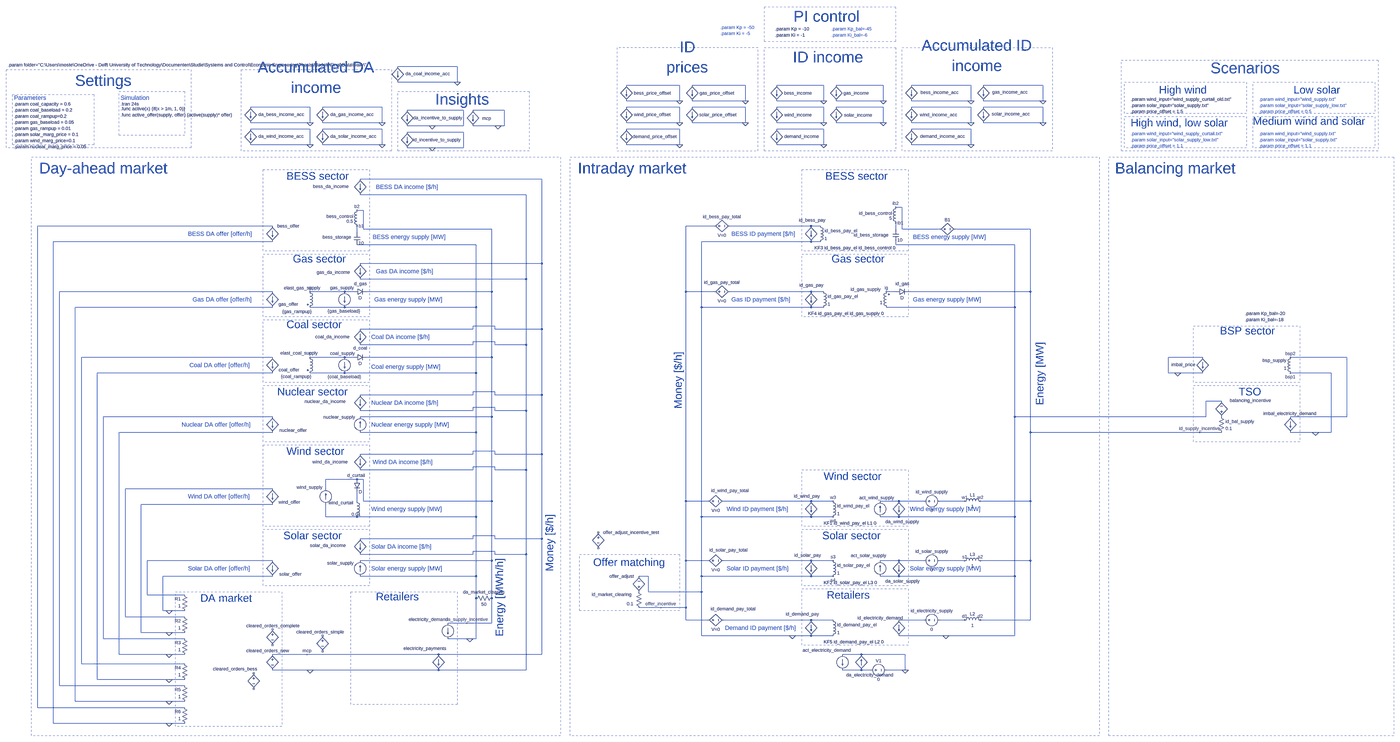
[diagram p0: schematic base.asc, whole sheet]
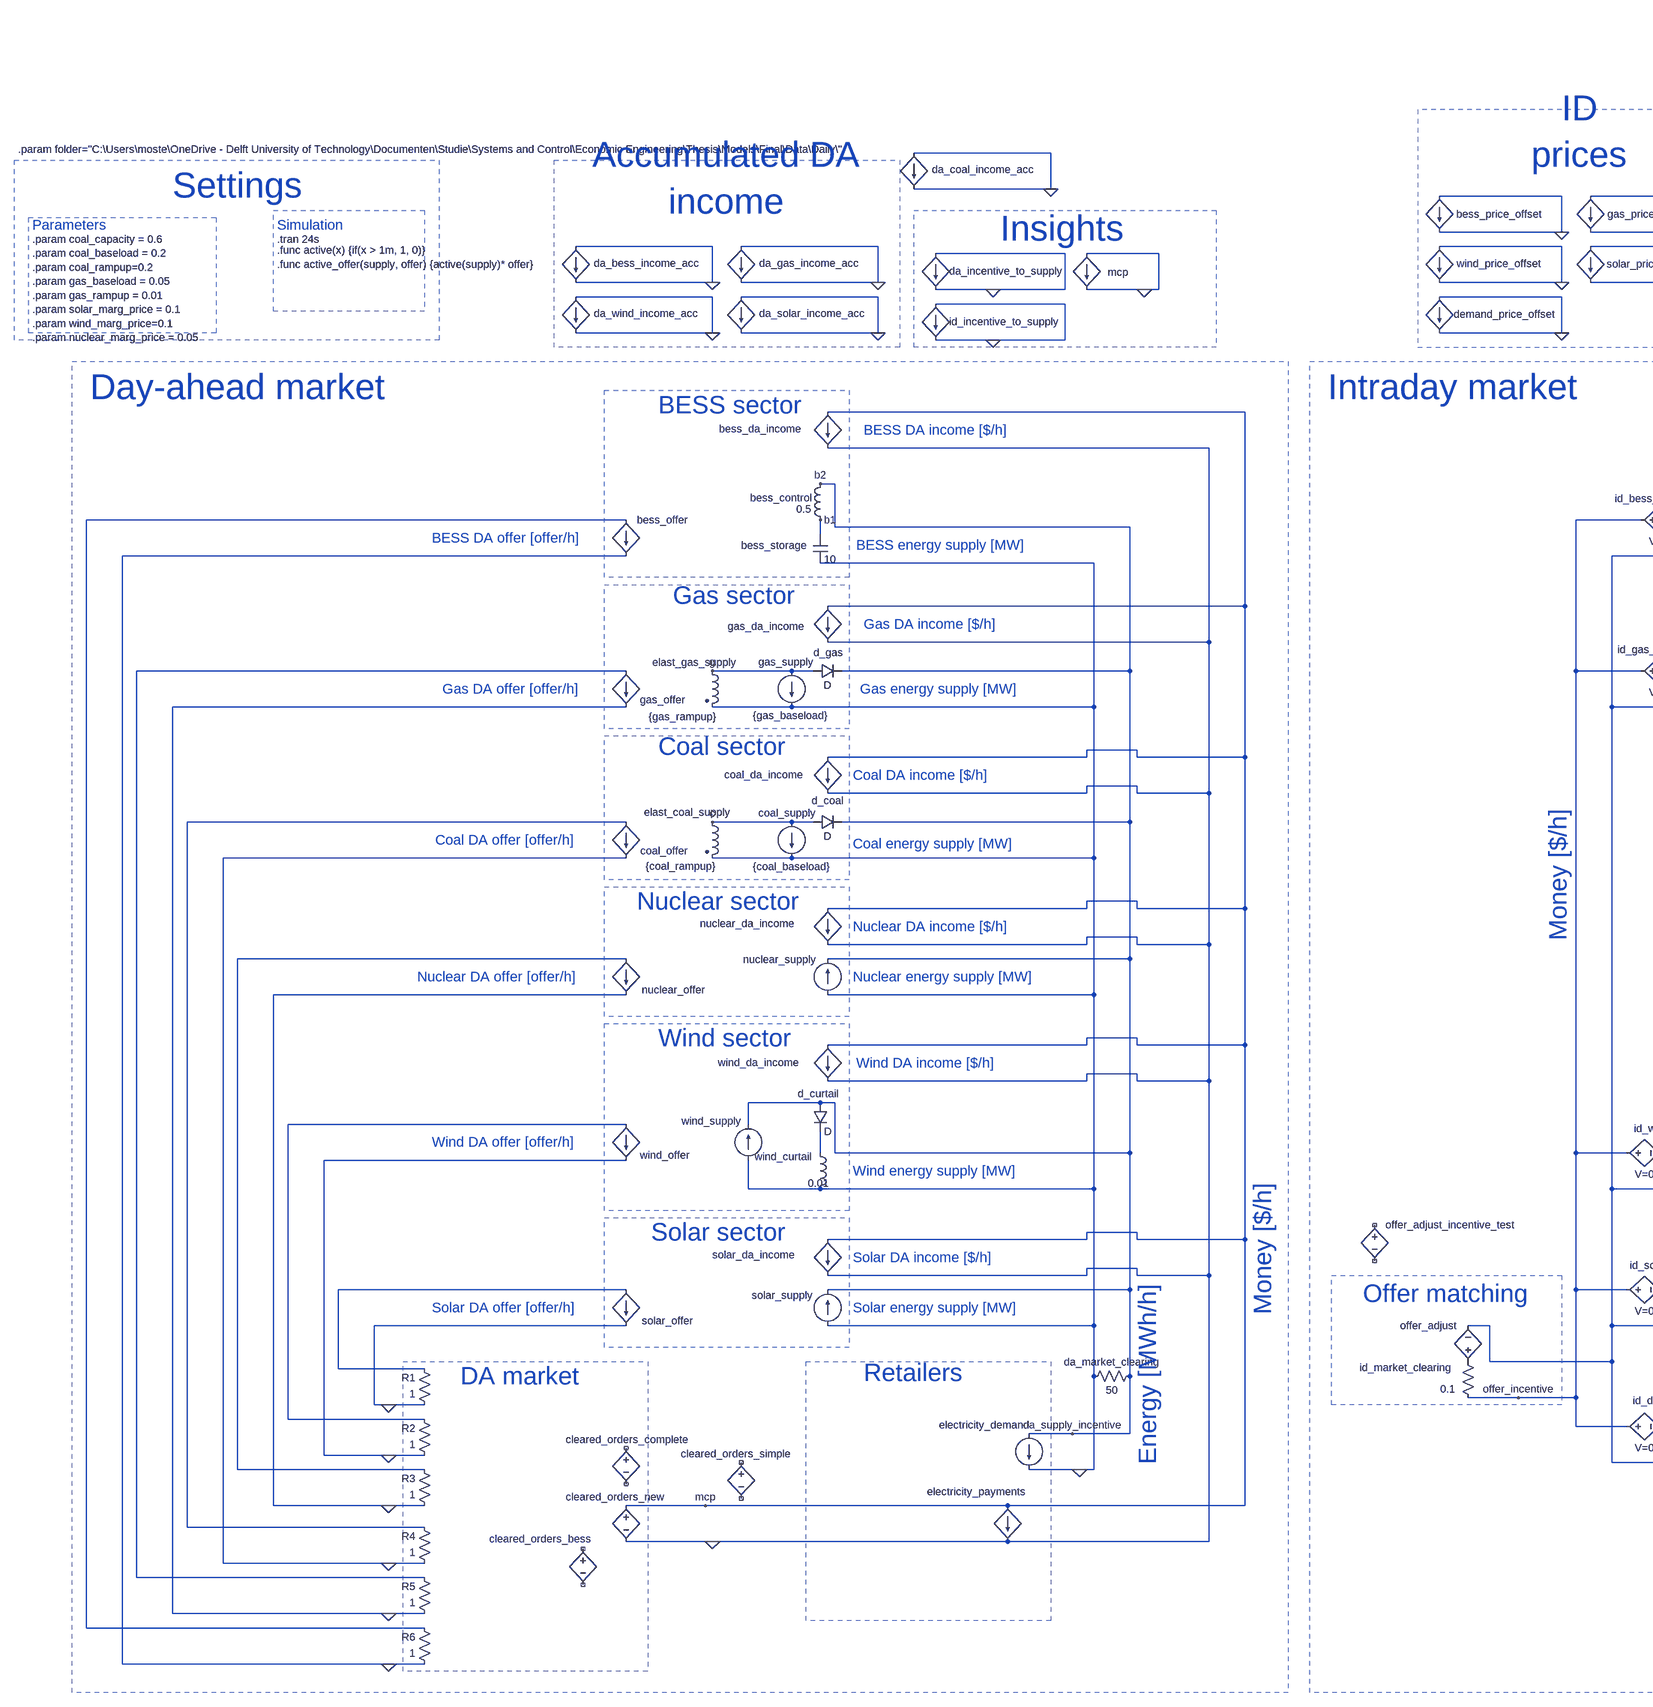
[diagram p1: schematic base.asc, part, row 1 of 1, column 1 of 2]
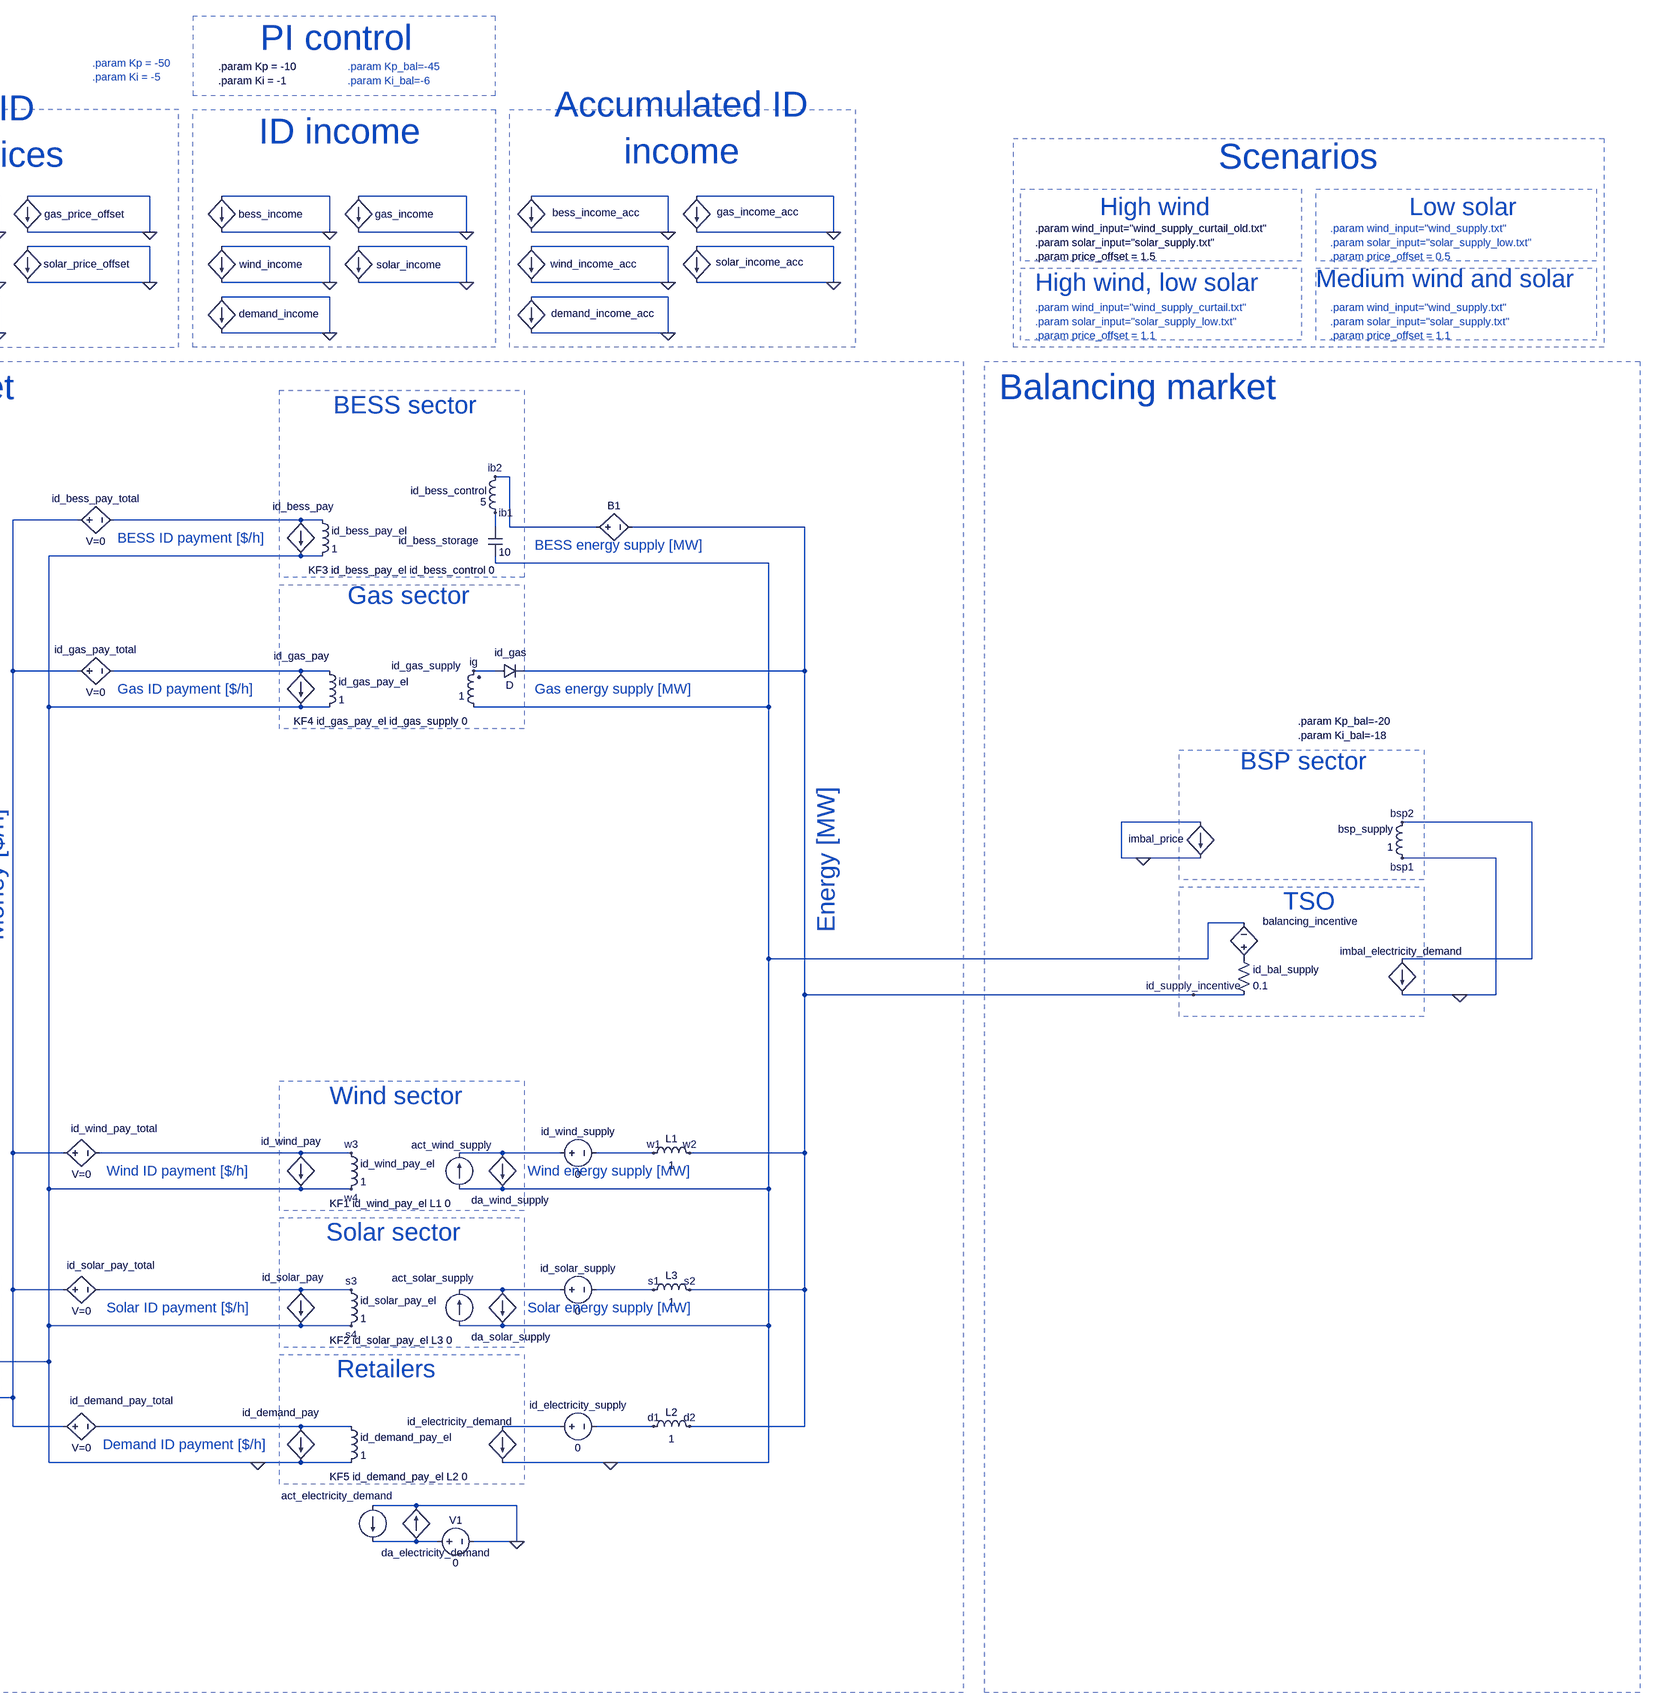
[diagram p2: schematic base.asc, part, row 1 of 1, column 2 of 2]
base.asc, the LTspice schematic file:
Version 4.1
SHEET 1 7964 2928
WIRE 2464 -1344 2160 -1344
WIRE 2464 -1264 2464 -1344
WIRE 2464 -1264 2160 -1264
WIRE 3600 -1248 3328 -1248
WIRE 3936 -1248 3664 -1248
WIRE 4336 -1248 4096 -1248
WIRE 4640 -1248 4400 -1248
WIRE 5088 -1248 4784 -1248
WIRE 5456 -1248 5152 -1248
WIRE 3600 -1168 3600 -1248
WIRE 3600 -1168 3328 -1168
WIRE 3936 -1168 3936 -1248
WIRE 3936 -1168 3664 -1168
WIRE 4336 -1168 4336 -1248
WIRE 4336 -1168 4096 -1168
WIRE 4640 -1168 4640 -1248
WIRE 4640 -1168 4400 -1168
WIRE 5088 -1168 5088 -1248
WIRE 5088 -1168 4784 -1168
WIRE 5456 -1168 5456 -1248
WIRE 5456 -1168 5152 -1168
WIRE 1712 -1136 1408 -1136
WIRE 2080 -1136 1776 -1136
WIRE 3600 -1136 3328 -1136
WIRE 3936 -1136 3664 -1136
WIRE 4336 -1136 4096 -1136
WIRE 4640 -1136 4400 -1136
WIRE 5088 -1136 4784 -1136
WIRE 5456 -1136 5152 -1136
WIRE 2496 -1120 2208 -1120
WIRE 2704 -1120 2544 -1120
WIRE 1712 -1056 1712 -1136
WIRE 1712 -1056 1408 -1056
WIRE 2080 -1056 2080 -1136
WIRE 2080 -1056 1776 -1056
WIRE 3600 -1056 3600 -1136
WIRE 3600 -1056 3328 -1056
WIRE 3936 -1056 3936 -1136
WIRE 3936 -1056 3664 -1056
WIRE 4336 -1056 4336 -1136
WIRE 4336 -1056 4096 -1056
WIRE 4640 -1056 4640 -1136
WIRE 4640 -1056 4400 -1056
WIRE 5088 -1056 5088 -1136
WIRE 5088 -1056 4784 -1056
WIRE 5456 -1056 5456 -1136
WIRE 5456 -1056 5152 -1056
WIRE 2336 -1040 2208 -1040
WIRE 2496 -1040 2496 -1120
WIRE 2496 -1040 2336 -1040
WIRE 2672 -1040 2544 -1040
WIRE 2704 -1040 2704 -1120
WIRE 2704 -1040 2672 -1040
WIRE 1712 -1024 1408 -1024
WIRE 2080 -1024 1776 -1024
WIRE 3600 -1024 3328 -1024
WIRE 4336 -1024 4096 -1024
WIRE 5088 -1024 4784 -1024
WIRE 2496 -1008 2208 -1008
WIRE 1712 -944 1712 -1024
WIRE 1712 -944 1408 -944
WIRE 2080 -944 2080 -1024
WIRE 2080 -944 1776 -944
WIRE 3600 -944 3600 -1024
WIRE 3600 -944 3328 -944
WIRE 4336 -944 4336 -1024
WIRE 4336 -944 4096 -944
WIRE 5088 -944 5088 -1024
WIRE 5088 -944 4784 -944
WIRE 2336 -928 2208 -928
WIRE 2496 -928 2496 -1008
WIRE 2496 -928 2336 -928
WIRE 2896 -768 1968 -768
WIRE 2816 -688 1968 -688
WIRE 4736 -624 4704 -624
WIRE 1984 -608 1952 -608
WIRE 1520 -528 320 -528
WIRE 3776 -528 3632 -528
WIRE 4272 -528 3856 -528
WIRE 4320 -528 4272 -528
WIRE 1984 -512 1984 -608
WIRE 2640 -512 1984 -512
WIRE 4704 -512 4704 -544
WIRE 4736 -512 4736 -624
WIRE 4928 -512 4736 -512
WIRE 5392 -512 5008 -512
WIRE 1952 -496 1952 -528
WIRE 1520 -448 400 -448
WIRE 4272 -448 3712 -448
WIRE 4320 -448 4272 -448
WIRE 2560 -432 1952 -432
WIRE 4704 -432 4704 -448
WIRE 5312 -432 4704 -432
WIRE 2896 -336 2896 -768
WIRE 2896 -336 1968 -336
WIRE 2816 -256 2816 -688
WIRE 2816 -256 1968 -256
WIRE 1520 -192 432 -192
WIRE 1888 -192 1712 -192
WIRE 1936 -192 1888 -192
WIRE 2640 -192 2640 -512
WIRE 2640 -192 2000 -192
WIRE 3632 -192 3632 -528
WIRE 3776 -192 3632 -192
WIRE 4272 -192 3856 -192
WIRE 4336 -192 4272 -192
WIRE 4704 -192 4656 -192
WIRE 5392 -192 5392 -512
WIRE 5392 -192 4768 -192
WIRE 1520 -112 512 -112
WIRE 1888 -112 1712 -112
WIRE 2560 -112 2560 -432
WIRE 2560 -112 1888 -112
WIRE 3712 -112 3712 -448
WIRE 4272 -112 3712 -112
WIRE 4336 -112 4272 -112
WIRE 5312 -112 5312 -432
WIRE 5312 -112 4656 -112
WIRE 2656 -16 2544 -16
WIRE 2544 0 2544 -16
WIRE 2544 0 1968 0
WIRE 2656 0 2656 -16
WIRE 2896 0 2896 -336
WIRE 2896 0 2656 0
WIRE 2656 64 2544 64
WIRE 2544 80 2544 64
WIRE 2544 80 1968 80
WIRE 2656 80 2656 64
WIRE 2816 80 2816 -256
WIRE 2816 80 2656 80
WIRE 1520 144 544 144
WIRE 1888 144 1712 144
WIRE 1936 144 1888 144
WIRE 2640 144 2640 -192
WIRE 2640 144 2000 144
WIRE 6272 144 6096 144
WIRE 7008 144 6720 144
WIRE 1520 224 624 224
WIRE 1888 224 1712 224
WIRE 2560 224 2560 -112
WIRE 2560 224 1888 224
WIRE 6096 224 6096 144
WIRE 6144 224 6096 224
WIRE 6272 224 6144 224
WIRE 6928 224 6720 224
WIRE 2656 320 2544 320
WIRE 2544 336 2544 320
WIRE 2544 336 1968 336
WIRE 2656 336 2656 320
WIRE 2896 336 2896 0
WIRE 2896 336 2656 336
WIRE 6368 368 6288 368
WIRE 2656 400 2544 400
WIRE 2544 416 2544 400
WIRE 2544 416 1968 416
WIRE 2656 416 2656 400
WIRE 2816 416 2816 80
WIRE 2816 416 2656 416
WIRE 1520 448 656 448
WIRE 2640 448 2640 144
WIRE 2640 448 1968 448
WIRE 5312 448 5312 -112
WIRE 6288 448 6288 368
WIRE 6288 448 5312 448
WIRE 7008 448 7008 144
WIRE 7008 448 6720 448
WIRE 1520 528 736 528
WIRE 2560 528 2560 224
WIRE 2560 528 1968 528
WIRE 5392 528 5392 -192
WIRE 6256 528 5392 528
WIRE 6368 528 6256 528
WIRE 6848 528 6720 528
WIRE 6928 528 6928 224
WIRE 6928 528 6848 528
WIRE 2656 624 2544 624
WIRE 2544 640 2544 624
WIRE 2544 640 1968 640
WIRE 2656 640 2656 624
WIRE 2896 640 2896 336
WIRE 2896 640 2656 640
WIRE 2656 704 2544 704
WIRE 2544 720 2544 704
WIRE 2544 720 1968 720
WIRE 2656 720 2656 704
WIRE 2816 720 2816 416
WIRE 2816 720 2656 720
WIRE 1952 768 1792 768
WIRE 1984 768 1952 768
WIRE 1520 816 768 816
WIRE 1792 816 1792 768
WIRE 1952 880 1952 832
WIRE 1984 880 1984 768
WIRE 2640 880 2640 448
WIRE 2640 880 1984 880
WIRE 3632 880 3632 -192
WIRE 3744 880 3632 880
WIRE 4272 880 3824 880
WIRE 4384 880 4272 880
WIRE 4720 880 4624 880
WIRE 4848 880 4720 880
WIRE 5056 880 4928 880
WIRE 5392 880 5392 528
WIRE 5392 880 5136 880
WIRE 1520 896 848 896
WIRE 1792 960 1792 896
WIRE 1952 960 1792 960
WIRE 2560 960 2560 528
WIRE 2560 960 1952 960
WIRE 3712 960 3712 -112
WIRE 4272 960 3712 960
WIRE 4384 960 4272 960
WIRE 4720 960 4624 960
WIRE 5312 960 5312 448
WIRE 5312 960 4720 960
WIRE 2656 1056 2544 1056
WIRE 2544 1072 2544 1056
WIRE 2544 1072 1968 1072
WIRE 2656 1072 2656 1056
WIRE 2896 1072 2896 640
WIRE 2896 1072 2656 1072
WIRE 2656 1136 2544 1136
WIRE 2544 1152 2544 1136
WIRE 2544 1152 1968 1152
WIRE 2656 1152 2656 1136
WIRE 2816 1152 2816 720
WIRE 2816 1152 2656 1152
WIRE 1520 1184 880 1184
WIRE 2640 1184 2640 880
WIRE 2640 1184 1968 1184
WIRE 3632 1184 3632 880
WIRE 3744 1184 3632 1184
WIRE 4272 1184 3824 1184
WIRE 4384 1184 4272 1184
WIRE 4720 1184 4624 1184
WIRE 4848 1184 4720 1184
WIRE 5056 1184 4928 1184
WIRE 5392 1184 5392 880
WIRE 5392 1184 5136 1184
WIRE 1520 1264 960 1264
WIRE 2560 1264 2560 960
WIRE 2560 1264 1968 1264
WIRE 3440 1264 3392 1264
WIRE 3712 1264 3712 960
WIRE 4272 1264 3712 1264
WIRE 4384 1264 4272 1264
WIRE 4720 1264 4624 1264
WIRE 5312 1264 5312 960
WIRE 5312 1264 4720 1264
WIRE 3440 1344 3440 1264
WIRE 3712 1344 3712 1264
WIRE 3712 1344 3440 1344
WIRE 880 1360 880 1184
WIRE 1072 1360 880 1360
WIRE 2560 1376 2560 1264
WIRE 2640 1376 2640 1184
WIRE 3504 1424 3392 1424
WIRE 3632 1424 3632 1184
WIRE 3632 1424 3504 1424
WIRE 960 1440 960 1264
WIRE 992 1440 960 1440
WIRE 1072 1440 992 1440
WIRE 768 1472 768 816
WIRE 1072 1472 768 1472
WIRE 3632 1488 3632 1424
WIRE 3744 1488 3632 1488
WIRE 4272 1488 3824 1488
WIRE 4384 1488 4272 1488
WIRE 4848 1488 4720 1488
WIRE 5056 1488 4928 1488
WIRE 5392 1488 5392 1184
WIRE 5392 1488 5136 1488
WIRE 2512 1504 2416 1504
WIRE 2640 1504 2640 1376
WIRE 2640 1504 2512 1504
WIRE 848 1552 848 896
WIRE 992 1552 848 1552
WIRE 1072 1552 992 1552
WIRE 3712 1568 3712 1344
WIRE 4176 1568 3712 1568
WIRE 4272 1568 4176 1568
WIRE 4384 1568 4272 1568
WIRE 4960 1568 4720 1568
WIRE 5312 1568 5312 1264
WIRE 5312 1568 4960 1568
WIRE 656 1584 656 448
WIRE 1072 1584 656 1584
WIRE 2528 1584 2416 1584
WIRE 2560 1584 2560 1376
WIRE 2560 1584 2528 1584
WIRE 736 1664 736 528
WIRE 992 1664 736 1664
WIRE 1072 1664 992 1664
WIRE 1696 1664 1520 1664
WIRE 2368 1664 1696 1664
WIRE 2896 1664 2896 1072
WIRE 2896 1664 2368 1664
WIRE 4528 1664 4432 1664
WIRE 4752 1664 4528 1664
WIRE 544 1712 544 144
WIRE 1072 1712 544 1712
WIRE 1712 1744 1520 1744
WIRE 2368 1744 1712 1744
WIRE 2816 1744 2816 1152
WIRE 2816 1744 2368 1744
WIRE 4528 1744 4432 1744
WIRE 4576 1744 4528 1744
WIRE 4752 1744 4752 1664
WIRE 4752 1744 4656 1744
WIRE 624 1792 624 224
WIRE 992 1792 624 1792
WIRE 1072 1792 992 1792
WIRE 432 1824 432 -192
WIRE 1072 1824 432 1824
WIRE 512 1904 512 -112
WIRE 992 1904 512 1904
WIRE 1072 1904 992 1904
WIRE 320 1936 320 -528
WIRE 1072 1936 320 1936
WIRE 400 2016 400 -448
WIRE 992 2016 400 2016
WIRE 1072 2016 992 2016
FLAG 2528 1584 0
FLAG 1712 144 c
FLAG 1712 -192 g
FLAG 992 1440 0
FLAG 992 1552 0
FLAG 992 1664 0
FLAG 992 1792 0
FLAG 992 1904 0
FLAG 1712 1744 0
FLAG 1696 1664 mcp
FLAG 1952 -528 b1
FLAG 1952 -608 b2
FLAG 2672 -1040 0
FLAG 992 2016 0
FLAG 4656 -192 ig
FLAG 4704 -544 ib1
FLAG 6256 528 id_supply_incentive
FLAG 2336 -1040 0
FLAG 4176 1568 0
FLAG 5056 880 w1
FLAG 5136 880 w2
FLAG 5056 1184 s1
FLAG 5136 1184 s2
FLAG 4384 880 w3
FLAG 4384 960 w4
FLAG 4384 1184 s3
FLAG 4384 1264 s4
FLAG 5056 1488 d1
FLAG 5136 1488 d2
FLAG 4704 -624 ib2
FLAG 3600 -1056 0
FLAG 3600 -1168 0
FLAG 3936 -1056 0
FLAG 3600 -944 0
FLAG 4960 1568 0
FLAG 4752 1744 0
FLAG 4336 -944 0
FLAG 4640 -1056 0
FLAG 4336 -1056 0
FLAG 4336 -1168 0
FLAG 5088 -944 0
FLAG 3936 -1168 0
FLAG 4640 -1168 0
FLAG 5456 -1056 0
FLAG 5088 -1056 0
FLAG 5088 -1168 0
FLAG 5456 -1168 0
FLAG 6848 528 0
FLAG 6720 224 bsp1
FLAG 6720 144 bsp2
FLAG 6144 224 0
FLAG 2080 -944 0
FLAG 1712 -944 0
FLAG 1712 -1056 0
FLAG 2080 -1056 0
FLAG 3504 1424 offer_incentive
FLAG 2512 1504 da_supply_incentive
FLAG 2464 -1264 0
FLAG 2336 -928 0
DATAFLAG 2816 -224 ""
SYMBOL ind 1936 864 R0
WINDOW 0 -130 24 Left 2
WINDOW 3 -12 83 Left 2
SYMATTR InstName wind_curtail
SYMATTR Value 0.01
SYMBOL diode 1936 768 R0
WINDOW 0 -34 -20 Left 2
SYMATTR InstName d_curtail
SYMBOL current 1968 1264 R180
WINDOW 0 33 68 Left 2
WINDOW 3 24 0 Invisible 2
WINDOW 123 0 0 Left 0
WINDOW 39 0 0 Left 0
SYMATTR InstName solar_supply
SYMATTR Value PWL file={folder+ solar_input}
SYMBOL current 1792 896 R180
WINDOW 0 16 87 Left 2
WINDOW 3 24 0 Invisible 2
WINDOW 123 0 0 Left 0
WINDOW 39 0 0 Left 0
SYMATTR InstName wind_supply
SYMATTR Value PWL file={folder+ wind_input}
SYMBOL current 1968 528 R180
WINDOW 0 25 78 Left 2
WINDOW 3 24 80 Invisible 2
WINDOW 123 0 0 Left 0
WINDOW 39 0 0 Left 0
SYMATTR InstName nuclear_supply
SYMATTR Value PWL file="C:\Users\moste\OneDrive - Delft University of Technology\Documenten\Studie\Systems and Control\Economic Engineering\Thesis\Models\Data\nuclear_supply.txt"
SYMBOL current 1888 144 R0
WINDOW 0 -74 -20 Left 2
WINDOW 3 -86 99 Left 2
WINDOW 123 0 0 Left 0
WINDOW 39 0 0 Left 0
SYMATTR InstName coal_supply
SYMATTR Value {coal_baseload}
SYMBOL ind2 1696 128 R0
WINDOW 0 -136 -6 Left 2
WINDOW 3 -133 114 Left 2
SYMATTR InstName elast_coal_supply
SYMATTR Value {coal_rampup}
SYMATTR Type ind
SYMATTR SpiceLine Rser=1u
SYMBOL diode 1936 160 R270
WINDOW 0 48 32 VTop 2
WINDOW 3 0 32 VBottom 2
SYMATTR InstName d_coal
SYMBOL current 1888 -192 R0
WINDOW 0 -74 -20 Left 2
WINDOW 3 -86 99 Left 2
WINDOW 123 0 0 Left 0
WINDOW 39 0 0 Left 0
SYMATTR InstName gas_supply
SYMATTR Value {gas_baseload}
SYMBOL ind2 1696 -208 R0
WINDOW 0 -118 -3 Left 2
WINDOW 3 -126 118 Left 2
SYMATTR InstName elast_gas_supply
SYMATTR Value {gas_rampup}
SYMATTR Type ind
SYMATTR SpiceLine Rser=1u
SYMBOL diode 1936 -176 R270
WINDOW 0 41 34 VTop 2
WINDOW 3 0 32 VBottom 2
SYMATTR InstName d_gas
SYMBOL current 2416 1504 R0
WINDOW 0 2 -19 Right 2
WINDOW 3 24 80 Invisible 2
WINDOW 123 0 0 Left 0
WINDOW 39 0 0 Left 0
SYMATTR InstName electricity_demand
SYMATTR Value PWL file="C:\Users\moste\OneDrive - Delft University of Technology\Documenten\Studie\Systems and Control\Economic Engineering\Thesis\Models\Data\electricity_demand_extended_increased.txt"
SYMBOL bi 1520 -192 R0
WINDOW 0 31 64 Left 2
WINDOW 3 24 80 Invisible 2
SYMATTR InstName gas_offer
SYMATTR Value I=I(d_gas)*{gas_rampup}*50
SYMBOL bi 1520 144 R0
WINDOW 0 32 64 Left 2
WINDOW 3 24 80 Invisible 2
SYMATTR InstName coal_offer
SYMATTR Value I=I(d_coal)*{coal_rampup}*2.5
SYMBOL bi 1520 448 R0
WINDOW 0 35 69 Left 2
WINDOW 3 24 80 Invisible 2
SYMATTR InstName nuclear_offer
SYMATTR Value I=active_offer(I(nuclear_supply), {nuclear_marg_price})
SYMBOL bi 1520 816 R0
WINDOW 0 31 69 Left 2
WINDOW 3 24 80 Invisible 2
SYMATTR InstName wind_offer
SYMATTR Value I=active_offer(I(wind_supply), -{wind_marg_price})
SYMBOL bi 1520 1184 R0
WINDOW 0 35 69 Left 2
WINDOW 3 24 80 Invisible 2
SYMATTR InstName solar_offer
SYMATTR Value I=active_offer(I(solar_supply), -{solar_marg_price})
SYMBOL res 1088 1456 R180
WINDOW 0 36 76 Left 2
WINDOW 3 36 40 Left 2
SYMATTR InstName R1
SYMATTR Value 1
SYMBOL res 1088 1568 R180
WINDOW 0 36 76 Left 2
WINDOW 3 36 40 Left 2
SYMATTR InstName R2
SYMATTR Value 1
SYMBOL res 1088 1680 R180
WINDOW 0 36 76 Left 2
WINDOW 3 36 40 Left 2
SYMATTR InstName R3
SYMATTR Value 1
SYMBOL res 1088 1808 R180
WINDOW 0 36 76 Left 2
WINDOW 3 36 40 Left 2
SYMATTR InstName R4
SYMATTR Value 1
SYMBOL res 1088 1920 R180
WINDOW 0 36 76 Left 2
WINDOW 3 36 40 Left 2
SYMATTR InstName R5
SYMATTR Value 1
SYMBOL bi 1968 -336 R0
WINDOW 3 24 80 Invisible 2
WINDOW 0 -222 45 Left 2
SYMATTR Value I=V(mcp)*I(d_gas)
SYMATTR InstName gas_da_income
SYMBOL bi 1968 0 R0
WINDOW 3 24 80 Invisible 2
WINDOW 0 -230 39 Left 2
SYMATTR Value I=V(mcp)*I(d_coal)
SYMATTR InstName coal_da_income
SYMBOL bi 1968 336 R0
WINDOW 3 24 80 Invisible 2
WINDOW 0 -284 34 Left 2
SYMATTR Value I=V(mcp)*I(nuclear_supply)
SYMATTR InstName nuclear_da_income
SYMBOL bi 1968 640 R0
WINDOW 3 24 80 Invisible 2
WINDOW 0 -244 39 Left 2
SYMATTR Value I=V(mcp)*I(wind_supply)
SYMATTR InstName wind_da_income
SYMBOL bi 1968 1072 R0
WINDOW 3 24 80 Invisible 2
WINDOW 0 -256 34 Left 2
SYMATTR Value I=V(mcp)*I(solar_supply)
SYMATTR InstName solar_da_income
SYMBOL bv 1776 1552 R0
WINDOW 3 24 96 Invisible 2
WINDOW 0 -134 -3 Left 2
SYMATTR Value V = MAX(I(R4), I(R5))
SYMATTR InstName cleared_orders_simple
SYMBOL bv 1520 1520 R0
WINDOW 3 24 96 Invisible 2
WINDOW 0 -134 -3 Left 2
SYMATTR Value V = MAX(I(R1), MAX(I(R2), MAX(I(R3), MAX(I(R4), I(R5)))))
SYMATTR InstName cleared_orders_complete
SYMBOL bi 2368 1664 R0
WINDOW 0 -179 -31 Left 2
WINDOW 3 24 80 Invisible 2
SYMATTR InstName electricity_payments
SYMATTR Value I=V(mcp)*I(electricity_demand)
SYMBOL ind 1968 -512 R180
WINDOW 0 35 65 Left 2
WINDOW 3 36 40 Left 2
SYMATTR InstName bess_control
SYMATTR Value 0.5
SYMBOL cap 1936 -496 R0
WINDOW 0 -160 25 Left 2
SYMATTR InstName bess_storage
SYMATTR Value 10
SYMBOL bi 1520 -528 R0
WINDOW 3 24 80 Invisible 2
SYMATTR Value I=idt(V(b1)-V(b2))
SYMATTR InstName bess_offer
SYMBOL res 1088 2032 R180
WINDOW 0 36 76 Left 2
WINDOW 3 36 40 Left 2
SYMATTR InstName R6
SYMATTR Value 1
SYMBOL bv 1424 1744 R0
WINDOW 3 24 96 Invisible 2
WINDOW 0 -208 -6 Left 2
SYMATTR Value V = MAX(I(R4), MAX(I(R5), I(R6)))
SYMATTR InstName cleared_orders_bess
SYMBOL bi 2544 -1120 R0
WINDOW 0 47 41 Left 2
WINDOW 3 24 80 Invisible 2
SYMATTR InstName mcp
SYMATTR Value I=I(electricity_payments)/I(electricity_demand)
SYMBOL bi 1968 -768 R0
WINDOW 0 -241 38 Left 2
WINDOW 3 -106 85 Invisible 2
SYMATTR InstName bess_da_income
SYMATTR Value I=V(mcp)*I(bess_control)
SYMBOL ind2 4672 -96 R180
WINDOW 0 44 108 Left 2
WINDOW 3 36 40 Left 2
SYMATTR InstName id_gas_supply
SYMATTR Value 1
SYMATTR Type ind
SYMATTR SpiceLine Rser=1u
SYMBOL bi 4272 -192 R0
WINDOW 0 -60 -33 Left 2
WINDOW 3 24 80 Invisible 2
SYMATTR InstName id_gas_pay
SYMATTR Value I=10*idt(- V(ig))*I(id_gas)
SYMBOL res 6352 432 R0
SYMATTR InstName id_bal_supply
SYMATTR Value 0.1
SYMBOL ind 4720 -528 R180
WINDOW 0 35 65 Left 2
WINDOW 3 36 40 Left 2
SYMATTR InstName id_bess_control
SYMATTR Value 5
SYMATTR Type ind
SYMBOL cap 4688 -512 R0
WINDOW 0 -199 30 Left 2
SYMATTR InstName id_bess_storage
SYMATTR Value 10
SYMBOL bi 4272 -528 R0
WINDOW 3 24 80 Invisible 2
WINDOW 0 -63 -30 Left 2
SYMATTR Value I=(idt(V(ib1)-V(ib2)))*I(id_bess_control)
SYMATTR InstName id_bess_pay
SYMBOL current 4624 960 R180
WINDOW 0 -72 98 Left 2
WINDOW 3 24 0 Invisible 2
WINDOW 123 0 0 Left 0
WINDOW 39 0 0 Left 0
SYMATTR InstName act_wind_supply
SYMATTR Value PWL file="C:\Users\moste\OneDrive - Delft University of Technology\Documenten\Studie\Systems and Control\Economic Engineering\Thesis\Models\Final\Data\Daily\act_wind_supply_curtail.txt"
SYMBOL current 4624 1264 R180
WINDOW 0 -32 106 Left 2
WINDOW 3 24 0 Invisible 2
WINDOW 123 0 0 Left 0
WINDOW 39 0 0 Left 0
SYMATTR InstName act_solar_supply
SYMATTR Value PWL file="C:\Users\moste\OneDrive - Delft University of Technology\Documenten\Studie\Systems and Control\Economic Engineering\Thesis\Models\Data\act_solar_supply.txt"
SYMBOL bi 4720 880 R0
WINDOW 0 -69 105 Left 2
WINDOW 3 24 80 Invisible 2
SYMATTR InstName da_wind_supply
SYMATTR Value I=I(wind_supply)
SYMBOL current 4432 1664 R0
WINDOW 0 -204 -22 Left 2
WINDOW 3 24 0 Invisible 2
WINDOW 123 0 0 Left 0
WINDOW 39 0 0 Left 0
SYMATTR InstName act_electricity_demand
SYMATTR Value PWL file="C:\Users\moste\OneDrive - Delft University of Technology\Documenten\Studie\Systems and Control\Economic Engineering\Thesis\Models\Data\act_electricity_demand_extended_increased.txt"
SYMBOL bi 4720 1488 R0
WINDOW 0 -212 -11 Left 2
WINDOW 3 24 80 Invisible 2
SYMATTR InstName id_electricity_demand
SYMATTR Value I=I(act_electricity_demand)-I(electricity_demand)
SYMBOL bi 2208 -1120 R0
WINDOW 0 30 39 Left 2
WINDOW 3 24 80 Invisible 2
SYMATTR InstName da_incentive_to_supply
SYMATTR Value I=-V(da_supply_incentive)
SYMBOL diode 4704 -176 R270
WINDOW 0 41 34 VTop 2
WINDOW 3 0 32 VBottom 2
SYMATTR InstName id_gas
SYMBOL ind 5040 896 R270
WINDOW 0 32 56 VTop 2
WINDOW 3 4 56 VBottom 2
SYMATTR InstName L1
SYMATTR Value 1
SYMATTR Type ind
SYMATTR SpiceLine Rser=0.1
SYMBOL ind 5040 1200 R270
WINDOW 0 32 56 VTop 2
WINDOW 3 4 56 VBottom 2
SYMATTR InstName L3
SYMATTR Value 1
SYMATTR Type ind
SYMATTR SpiceLine Rser=0.1
SYMBOL bi 4272 1184 R0
WINDOW 3 24 80 Invisible 2
WINDOW 0 -86 -28 Left 2
SYMATTR Value I=idt(V(s1)-V(s2))*I(id_solar_supply)
SYMATTR InstName id_solar_pay
SYMBOL bi 4272 880 R0
WINDOW 3 24 80 Invisible 2
WINDOW 0 -89 -26 Left 2
SYMATTR Value I=idt(V(w1)-V(w2))*I(id_wind_supply)
SYMATTR InstName id_wind_pay
SYMBOL ind 4368 864 R0
SYMATTR InstName id_wind_pay_el
SYMATTR Value 1
SYMATTR Type ind
SYMATTR SpiceLine Rser=0.1
SYMBOL ind 4368 1168 R0
SYMATTR InstName id_solar_pay_el
SYMATTR Value 1
SYMATTR Type ind
SYMATTR SpiceLine Rser=0.1
SYMBOL res 3376 1328 R0
WINDOW 0 -225 29 Left 2
WINDOW 3 -46 77 Left 2
SYMATTR InstName id_market_clearing
SYMATTR Value 0.1
SYMBOL bv 3728 880 R270
WINDOW 0 39 130 VTop 2
WINDOW 3 -32 56 VBottom 2
SYMATTR InstName id_wind_pay_total
SYMATTR Value V=0
SYMBOL bv 3728 1184 R270
WINDOW 0 39 122 VTop 2
WINDOW 3 -32 56 VBottom 2
SYMATTR InstName id_solar_pay_total
SYMATTR Value V=0
SYMBOL ind 4304 -544 R0
SYMATTR InstName id_bess_pay_el
SYMATTR Value 1
SYMATTR Type ind
SYMATTR SpiceLine Rser=0.1
SYMBOL bv 3760 -528 R270
WINDOW 0 32 56 VTop 2
WINDOW 3 -32 56 VBottom 2
SYMATTR InstName id_bess_pay_total
SYMATTR Value V=0
SYMBOL ind 4320 -208 R0
SYMATTR InstName id_gas_pay_el
SYMATTR Value 1
SYMATTR Type ind
SYMATTR SpiceLine Rser=0.1
SYMBOL bv 3760 -192 R270
WINDOW 0 32 56 VTop 2
WINDOW 3 -32 56 VBottom 2
SYMATTR InstName id_gas_pay_total
SYMATTR Value V=0
SYMBOL ind 5040 1504 R270
WINDOW 0 32 56 VTop 2
WINDOW 3 4 56 VBottom 2
SYMATTR InstName L2
SYMATTR Value 1
SYMATTR Type ind
SYMATTR SpiceLine Rser=0.1
SYMBOL ind 4368 1472 R0
SYMATTR InstName id_demand_pay_el
SYMATTR Value 1
SYMATTR Type ind
SYMATTR SpiceLine Rser=0.1
SYMBOL bi 4272 1488 R0
WINDOW 3 24 80 Invisible 2
WINDOW 0 -130 -31 Left 2
SYMATTR Value I=idt(V(d1)-V(d2))*I(id_electricity_supply)
SYMATTR InstName id_demand_pay
SYMBOL bv 3728 1488 R270
WINDOW 0 42 146 VTop 2
WINDOW 3 -32 56 VBottom 2
SYMATTR InstName id_demand_pay_total
SYMATTR Value V=0
SYMBOL bv 6368 464 R180
WINDOW 0 -254 99 Left 2
WINDOW 3 24 16 Invisible 2
SYMATTR InstName balancing_incentive
SYMATTR Value V={Kp_bal}*I(id_bal_supply)+{Ki_bal}*idt(I(id_bal_supply))
SYMBOL bi 3328 -1136 R0
WINDOW 3 24 80 Invisible 2
WINDOW 0 39 38 Left 2
SYMATTR Value I=(I(id_wind_pay_total)+{price_offset})/(I(id_wind_supply)+{price_offset})
SYMATTR InstName wind_price_offset
SYMBOL bi 3664 -1136 R0
WINDOW 3 24 80 Invisible 2
WINDOW 0 36 39 Left 2
SYMATTR Value I=(I(id_solar_pay_total)+{price_offset})/(I(id_solar_supply)+{price_offset})
SYMATTR InstName solar_price_offset
SYMBOL bi 3328 -1248 R0
WINDOW 3 24 80 Invisible 2
WINDOW 0 38 40 Left 2
SYMATTR Value I=(I(id_bess_pay_total)+{price_offset})/(I(id_bess_control)+{price_offset})
SYMATTR InstName bess_price_offset
SYMBOL bi 3328 -1024 R0
WINDOW 3 24 80 Invisible 2
WINDOW 0 32 39 Left 2
SYMATTR Value I=(I(id_demand_pay_total)+{price_offset})/(I(id_electricity_supply)+{price_offset})
SYMATTR InstName demand_price_offset
SYMBOL voltage 4832 880 R270
WINDOW 0 32 56 VTop 2
WINDOW 3 -32 56 VBottom 2
SYMATTR InstName id_wind_supply
SYMATTR Value 0
SYMBOL bi 4528 1744 R180
WINDOW 0 -165 -25 Left 2
WINDOW 3 24 0 Invisible 2
SYMATTR InstName da_electricity_demand
SYMATTR Value I=I(electricity_demand)
SYMBOL bi 4720 1184 R0
WINDOW 0 -69 105 Left 2
WINDOW 3 24 80 Invisible 2
SYMATTR InstName da_solar_supply
SYMATTR Value I=I(solar_supply)
SYMBOL voltage 4832 1184 R270
WINDOW 0 32 56 VTop 2
WINDOW 3 -32 56 VBottom 2
SYMATTR InstName id_solar_supply
SYMATTR Value 0
SYMBOL voltage 4560 1744 R270
WINDOW 0 32 56 VTop 2
WINDOW 3 -32 56 VBottom 2
SYMATTR InstName V1
SYMATTR Value 0
SYMBOL voltage 4832 1488 R270
WINDOW 0 32 56 VTop 2
WINDOW 3 -32 56 VBottom 2
SYMATTR InstName id_electricity_supply
SYMATTR Value 0
SYMBOL bi 4096 -1248 R0
WINDOW 0 37 40 Left 2
WINDOW 3 24 80 Invisible 2
SYMATTR InstName bess_income
SYMATTR Value I=I(id_bess_control)*I(bess_price_offset)
SYMBOL bi 4096 -1136 R0
WINDOW 0 39 40 Left 2
WINDOW 3 24 80 Invisible 2
SYMATTR InstName wind_income
SYMATTR Value I=I(id_wind_supply)*I(wind_price_offset)
SYMBOL bi 4400 -1136 R0
WINDOW 0 40 41 Left 2
WINDOW 3 24 80 Invisible 2
SYMATTR InstName solar_income
SYMATTR Value I=I(id_solar_supply)*I(solar_price_offset)
SYMBOL bi 4096 -1024 R0
WINDOW 0 38 38 Left 2
WINDOW 3 24 80 Invisible 2
SYMATTR InstName demand_income
SYMATTR Value I=I(id_electricity_supply)*I(demand_price_offset)
SYMBOL bi 4784 -1248 R0
WINDOW 0 47 37 Left 2
WINDOW 3 24 80 Invisible 2
SYMATTR InstName bess_income_acc
SYMATTR Value I=idt(I(bess_income))
SYMBOL bi 4784 -1136 R0
WINDOW 0 43 39 Left 2
WINDOW 3 24 80 Invisible 2
SYMATTR InstName wind_income_acc
SYMATTR Value I=idt(I(wind_income))
SYMBOL bi 5152 -1136 R0
WINDOW 0 42 35 Left 2
WINDOW 3 24 80 Invisible 2
SYMATTR InstName solar_income_acc
SYMATTR Value I=idt(I(solar_income))
SYMBOL bi 4784 -1024 R0
WINDOW 0 44 37 Left 2
WINDOW 3 24 80 Invisible 2
SYMATTR InstName demand_income_acc
SYMATTR Value I=idt(I(demand_income))
SYMBOL bi 3664 -1248 R0
WINDOW 3 24 80 Invisible 2
WINDOW 0 38 40 Left 2
SYMATTR Value I=(I(id_gas_pay_total)+{price_offset})/(I(id_gas)+{price_offset})
SYMATTR InstName gas_price_offset
SYMBOL bi 4400 -1248 R0
WINDOW 0 37 40 Left 2
WINDOW 3 24 80 Invisible 2
SYMATTR InstName gas_income
SYMATTR Value I=I(id_gas)*I(gas_price_offset)
SYMBOL bi 5152 -1248 R0
WINDOW 0 45 35 Left 2
WINDOW 3 24 80 Invisible 2
SYMATTR InstName gas_income_acc
SYMATTR Value I=idt(I(gas_income))
SYMBOL bv 3392 1360 R180
WINDOW 0 24 96 Left 2
WINDOW 3 24 16 Invisible 2
SYMATTR InstName offer_adjust
SYMATTR Value V={Kp}*I(id_market_clearing)+{Ki}*idt(I(id_market_clearing))
SYMBOL bi 6720 448 R0
WINDOW 0 -138 -17 Left 2
WINDOW 3 24 80 Invisible 2
SYMATTR InstName imbal_electricity_demand
SYMATTR Value I=I(id_bal_supply)
SYMBOL ind 6736 240 R180
WINDOW 0 36 80 Left 2
WINDOW 3 36 40 Left 2
SYMATTR InstName bsp_supply
SYMATTR Value 1
SYMBOL bi 6272 144 R0
WINDOW 3 24 80 Invisible 2
WINDOW 0 -160 37 Left 2
SYMATTR Value I=idt(V(bsp1)-V(bsp2))*10
SYMATTR InstName imbal_price
SYMBOL bi 1408 -1136 R0
WINDOW 0 40 37 Left 2
WINDOW 3 24 80 Invisible 2
SYMATTR InstName da_bess_income_acc
SYMATTR Value I=idt(I(bess_da_income))
SYMBOL bi 1776 -1136 R0
WINDOW 0 40 37 Left 2
WINDOW 3 24 80 Invisible 2
SYMATTR InstName da_gas_income_acc
SYMATTR Value I=idt(I(gas_da_income))
SYMBOL bi 1408 -1024 R0
WINDOW 0 40 37 Left 2
WINDOW 3 24 80 Invisible 2
SYMATTR InstName da_wind_income_acc
SYMATTR Value I=idt(I(wind_da_income))
SYMBOL bi 1776 -1024 R0
WINDOW 0 40 37 Left 2
WINDOW 3 24 80 Invisible 2
SYMATTR InstName da_solar_income_acc
SYMATTR Value I=idt(I(solar_da_income))
SYMBOL bv 3184 1024 R0
WINDOW 3 24 96 Invisible 2
SYMATTR Value V={Kp}*V(offer_incentive)+{Ki}*idt(V(offer_incentive))
SYMATTR InstName offer_adjust_incentive_test
SYMBOL bv 4912 -512 R270
WINDOW 0 32 56 VTop 2
WINDOW 3 -32 56 Invisible 2
SYMATTR InstName B1
SYMATTR Value V=0
SYMBOL res 2656 1360 R90
WINDOW 0 0 56 VBottom 2
WINDOW 3 32 56 VTop 2
SYMATTR InstName da_market_clearing
SYMATTR Value 50
SYMBOL bi 2160 -1344 R0
WINDOW 0 40 37 Left 2
WINDOW 3 24 80 Invisible 2
SYMATTR InstName da_coal_income_acc
SYMATTR Value I=idt(I(coal_da_income))
SYMBOL bi 2208 -1008 R0
WINDOW 0 30 39 Left 2
WINDOW 3 24 80 Invisible 2
SYMATTR InstName id_incentive_to_supply
SYMATTR Value I=-V(id_supply_incentive)
SYMBOL bv 1520 1648 R0
WINDOW 3 24 96 Invisible 2
WINDOW 0 -134 -3 Left 2
SYMATTR Value V = if( (I(R4)<1e-6) + (I(R5)<1e-6) > 0,min(I(R1), I(R2)),max(I(R4), I(R5)) )
SYMATTR InstName cleared_orders_new
TEXT 2024 1224 Left 3 ;Solar energy supply [MW]
TEXT 1576 1056 Left 5 ;Solar sector
TEXT 1592 624 Left 5 ;Wind sector
TEXT 1544 320 Left 5 ;Nuclear sector
TEXT 2024 920 Left 3 ;Wind energy supply [MW]
TEXT 2024 488 Left 3 ;Nuclear energy supply [MW]
TEXT 1592 -24 Left 5 ;Coal sector
TEXT 1624 -360 Left 5 ;Gas sector
TEXT 2024 192 Left 3 ;Coal energy supply [MW]
TEXT 2040 -152 Left 3 ;Gas energy supply [MW]
TEXT 512 -1272 Left 6 ;Settings
TEXT 200 -1152 Left 2 !.param coal_capacity = 0.6\n.param coal_baseload = 0.2\n.param coal_rampup=0.2\n.param gas_baseload = 0.05\n.param gas_rampup = 0.01\n.param solar_marg_price = 0.1\n.param wind_marg_price=0.1\n.param nuclear_marg_price = 0.05
TEXT 200 -1184 Left 3 ;Parameters
TEXT 744 -1152 Left 2 !.tran 24s
TEXT 744 -1184 Left 3 ;Simulation
TEXT 2048 1368 Left 5 ;Retailers
TEXT 2680 1168 VRight 5 ;Energy [MWh/h]
TEXT 1152 1376 Left 5 ;DA market
TEXT 744 -1128 Left 2 !.func active(x) {if(x > 1m, 1, 0)}
TEXT 744 -1096 Left 2 !.func active_offer(supply, offer) {active(supply)* offer}
TEXT 2024 1112 Left 3 ;Solar DA income [$/h]
TEXT 2032 680 Left 3 ;Wind DA income [$/h]
TEXT 2024 376 Left 3 ;Nuclear DA income [$/h]
TEXT 2024 40 Left 3 ;Coal DA income [$/h]
TEXT 2048 -296 Left 3 ;Gas DA income [$/h]
TEXT 1112 -152 Left 3 ;Gas DA offer [offer/h]
TEXT 1096 184 Left 3 ;Coal DA offer [offer/h]
TEXT 1056 488 Left 3 ;Nuclear DA offer [offer/h]
TEXT 1088 856 Left 3 ;Wind DA offer [offer/h]
TEXT 1088 1224 Left 3 ;Solar DA offer [offer/h]
TEXT 2936 944 VRight 5 ;Money [$/h]
TEXT 5904 -1176 Left 2 !.param wind_input="wind_supply_curtail_old.txt"\n.param solar_input="solar_supply.txt"\n.param price_offset = 1.5
TEXT 168 -1352 Left 2 !.param folder="C:\\Users\\moste\\OneDrive - Delft University of Technology\\Documenten\\Studie\\Systems and Control\\Economic Engineering\\Thesis\\Models\\Final\\Data\\Daily\\"
TEXT 6048 -1224 Left 5 ;High wind
TEXT 6560 -1176 Left 2 ;.param wind_input="wind_supply.txt"\n.param solar_input="solar_supply_low.txt"\n.param price_offset = 0.5
TEXT 6736 -1224 Left 5 ;Low solar
TEXT 6312 -1336 Left 6 ;Scenarios
TEXT 1592 -784 Left 5 ;BESS sector
TEXT 2352 -1176 Left 6 ;Insights
TEXT 328 -824 Left 6 ;Day-ahead market
TEXT 4776 1224 Left 3 ;Solar energy supply [MW]
TEXT 4328 1056 Left 5 ;Solar sector
TEXT 4336 752 Left 5 ;Wind sector
TEXT 4776 920 Left 3 ;Wind energy supply [MW]
TEXT 4376 -360 Left 5 ;Gas sector
TEXT 4792 -152 Left 3 ;Gas energy supply [MW]
TEXT 5440 64 VRight 5 ;Energy [MW]
TEXT 3864 -152 Left 3 ;Gas ID payment [$/h]
TEXT 3840 920 Left 3 ;Wind ID payment [$/h]
TEXT 3840 1224 Left 3 ;Solar ID payment [$/h]
TEXT 3592 112 VRight 5 ;Money [$/h]
TEXT 4344 -784 Left 5 ;BESS sector
TEXT 3080 -824 Left 6 ;Intraday market
TEXT 4336 992 Left 2 !KF1 id_wind_pay_el L1 0
TEXT 3864 -488 Left 3 ;BESS ID payment [$/h]
TEXT 5904 -1000 Left 2 ;.param wind_input="wind_supply_curtail.txt"\n.param solar_input="solar_supply_low.txt"\n.param price_offset = 1.1
TEXT 5904 -1056 Left 5 ;High wind, low solar
TEXT 4792 -472 Left 3 ;BESS energy supply [MW]
TEXT 4336 1296 Left 2 !KF2 id_solar_pay_el L3 0
TEXT 4088 -1536 Left 2 !.param Kp = -10\n.param Ki = -1
TEXT 4352 -1600 Center 6 ;PI control
TEXT 4288 -416 Left 2 !KF3 id_bess_pay_el id_bess_control 0
TEXT 4256 -80 Left 2 !KF4 id_gas_pay_el id_gas_supply 0
TEXT 4336 1600 Left 2 !KF5 id_demand_pay_el L2 0
TEXT 4352 1360 Left 5 ;Retailers
TEXT 4376 -1536 Left 2 ;.param Kp_bal=-45\n.param Ki_bal=-6
TEXT 3832 1528 Left 3 ;Demand ID payment [$/h]
TEXT 5824 -824 Left 6 ;Balancing market
TEXT 3344 1192 Center 5 ;Offer matching
TEXT 3640 -1392 Center 6 ;ID\nprices
TEXT 4360 -1392 Center 6 ;ID income
TEXT 5120 -1400 Center 6 ;Accumulated ID\nincome
TEXT 6488 -80 Left 2 !.param Kp_bal=-20\n.param Ki_bal=-18
TEXT 6456 320 Left 5 ;TSO
TEXT 6360 8 Left 5 ;BSP sector
TEXT 6560 -1000 Left 2 ;.param wind_input="wind_supply.txt"\n.param solar_input="solar_supply.txt"\n.param price_offset = 1.1
TEXT 6528 -1064 Left 5 ;Medium wind and solar
TEXT 3808 -1544 Left 2 ;.param Kp = -50\n.param Ki = -5
TEXT 1744 -1288 Center 6 ;Accumulated DA\nincome
TEXT 2032 -472 Left 3 ;BESS energy supply [MW]
TEXT 2048 -728 Left 3 ;BESS DA income [$/h]
TEXT 1088 -488 Left 3 ;BESS DA offer [offer/h]
RECTANGLE Normal 1072 -992 736 -1216 2
RECTANGLE Normal 608 -944 192 -1200 2
RECTANGLE Normal 1104 -928 160 -1328 2
RECTANGLE Normal 2464 1920 1920 1344 2
RECTANGLE Normal 1472 1024 2016 1312 2
RECTANGLE Normal 1472 592 2016 1008 2
RECTANGLE Normal 1472 288 2016 576 2
RECTANGLE Normal 1472 -48 2016 272 2
RECTANGLE Normal 1472 -384 2016 -64 2
RECTANGLE Normal 6496 -1104 5872 -1264 2
RECTANGLE Normal 7152 -1104 6528 -1264 2
RECTANGLE Normal 1472 -816 2016 -400 2
RECTANGLE Normal 1568 2032 1024 1344 2
RECTANGLE Normal 2832 -912 2160 -1216 2
RECTANGLE Normal 2992 2080 288 -880 2
RECTANGLE Normal 4224 1024 4768 1312 2
RECTANGLE Normal 4224 -384 4768 -64 2
RECTANGLE Normal 4224 -816 4768 -400 2
RECTANGLE Normal 5744 2080 3040 -880 2
RECTANGLE Normal 4224 720 4768 1008 2
RECTANGLE Normal 6496 -928 5872 -1088 2
RECTANGLE Normal 7168 -912 5856 -1376 2
RECTANGLE Normal 4224 1328 4768 1616 2
RECTANGLE Normal 3600 1440 3088 1152 2
RECTANGLE Normal 4704 -912 4032 -1440 2
RECTANGLE Normal 5504 -912 4736 -1440 2
RECTANGLE Normal 3280 -912 4000 -1440 2
RECTANGLE Normal 4704 -1648 4032 -1472 2
RECTANGLE Normal 5792 -880 7248 2080 2
RECTANGLE Normal 6224 288 6768 576 2
RECTANGLE Normal 6224 -16 6768 272 2
RECTANGLE Normal 7152 -928 6528 -1088 2
RECTANGLE Normal 2128 -912 1360 -1328 2

The netlist it stands for:
* base.asc
L§wind_curtail N008 0 0.01
d_curtail da_supply_incentive N008 D
I§solar_supply 0 da_supply_incentive PWL file={folder+ solar_input}
I§wind_supply 0 da_supply_incentive PWL file={folder+ wind_input}
I§nuclear_supply 0 da_supply_incentive PWL file="C:\Users\moste\OneDrive - Delft University of Technology\Documenten\Studie\Systems and Control\Economic Engineering\Thesis\Models\Data\nuclear_supply.txt"
I§coal_supply c 0 {coal_baseload}
L§elast_coal_supply c 0 {coal_rampup} Rser=1u
d_coal c da_supply_incentive D
I§gas_supply g 0 {gas_baseload}
L§elast_gas_supply g 0 {gas_rampup} Rser=1u
d_gas g da_supply_incentive D
I§electricity_demand da_supply_incentive 0 PWL file="C:\Users\moste\OneDrive - Delft University of Technology\Documenten\Studie\Systems and Control\Economic Engineering\Thesis\Models\Data\electricity_demand_extended_increased.txt"
B§gas_offer N003 0 I=I(d_gas)*{gas_rampup}*50
B§coal_offer N005 0 I=I(d_coal)*{coal_rampup}*2.5
B§nuclear_offer N006 0 I=active_offer(I(nuclear_supply), {nuclear_marg_price})
B§wind_offer N007 0 I=active_offer(I(wind_supply), -{wind_marg_price})
B§solar_offer N010 0 I=active_offer(I(solar_supply), -{solar_marg_price})
R1 0 N010 1
R2 0 N007 1
R3 0 N006 1
R4 0 N005 1
R5 0 N003 1
B§gas_da_income mcp 0 I=V(mcp)*I(d_gas)
B§coal_da_income mcp 0 I=V(mcp)*I(d_coal)
B§nuclear_da_income mcp 0 I=V(mcp)*I(nuclear_supply)
B§wind_da_income mcp 0 I=V(mcp)*I(wind_supply)
B§solar_da_income mcp 0 I=V(mcp)*I(solar_supply)
B§cleared_orders_simple NC_01 NC_02 V = MAX(I(R4), I(R5))
B§cleared_orders_complete NC_03 NC_04 V = MAX(I(R1), MAX(I(R2), MAX(I(R3), MAX(I(R4), I(R5)))))
B§electricity_payments mcp 0 I=V(mcp)*I(electricity_demand)
L§bess_control b1 da_supply_incentive 0.5
C§bess_storage b1 0 10
bess_offer N001 0 I=idt(V(b1)-V(b2))
R6 0 N001 1
B§cleared_orders_bess NC_05 NC_06 V = MAX(I(R4), MAX(I(R5), I(R6)))
B§mcp 0 0 I=I(electricity_payments)/I(electricity_demand)
bess_da_income mcp 0 I=V(mcp)*I(bess_control)
L§id_gas_supply 0 ig 1 Rser=1u
B§id_gas_pay N004 0 I=10*idt(- V(ig))*I(id_gas)
R§id_bal_supply P001 d2 0.1
L§id_bess_control ib1 ib2 5
C§id_bess_storage ib1 0 10
B§id_bess_pay N002 0 I=(idt(V(ib1)-V(ib2)))*I(id_bess_control)
I§act_wind_supply 0 N009 PWL file="C:\Users\moste\OneDrive - Delft University of Technology\Documenten\Studie\Systems and Control\Economic Engineering\Thesis\Models\Final\Data\Daily\act_wind_supply_curtail.txt"
I§act_solar_supply 0 N011 PWL file="C:\Users\moste\OneDrive - Delft University of Technology\Documenten\Studie\Systems and Control\Economic Engineering\Thesis\Models\Data\act_solar_supply.txt"
B§da_wind_supply N009 0 I=I(wind_supply)
I§act_electricity_demand 0 N014 PWL file="C:\Users\moste\OneDrive - Delft University of Technology\Documenten\Studie\Systems and Control\Economic Engineering\Thesis\Models\Data\act_electricity_demand_extended_increased.txt"
B§id_electricity_demand N013 0 I=I(act_electricity_demand)-I(electricity_demand)
B§da_incentive_to_supply 0 0 I=-V(da_supply_incentive)
D§id_gas ig d2 D
L1 w1 d2 1 Rser=0.1
L3 s1 d2 1 Rser=0.1
B§id_solar_pay s3 0 I=idt(V(s1)-V(s2))*I(id_solar_supply)
B§id_wind_pay w3 0 I=idt(V(w1)-V(w2))*I(id_wind_supply)
L§id_wind_pay_el w3 0 1 Rser=0.1
L§id_solar_pay_el s3 0 1 Rser=0.1
R§id_market_clearing P002 offer_incentive 0.1
B§id_wind_pay_total offer_incentive w3 V=0
B§id_solar_pay_total offer_incentive s3 V=0
L§id_bess_pay_el N002 0 1 Rser=0.1
B§id_bess_pay_total offer_incentive N002 V=0
L§id_gas_pay_el N004 0 1 Rser=0.1
B§id_gas_pay_total offer_incentive N004 V=0
L2 d1 d2 1 Rser=0.1
L§id_demand_pay_el N012 0 1 Rser=0.1
B§id_demand_pay N012 0 I=idt(V(d1)-V(d2))*I(id_electricity_supply)
B§id_demand_pay_total offer_incentive N012 V=0
balancing_incentive P001 0 V={Kp_bal}*I(id_bal_supply)+{Ki_bal}*idt(I(id_bal_supply))
B§wind_price_offset 0 0 I=(I(id_wind_pay_total)+{price_offset})/(I(id_wind_supply)+{price_offset})
B§solar_price_offset 0 0 I=(I(id_solar_pay_total)+{price_offset})/(I(id_solar_supply)+{price_offset})
bess_price_offset 0 0 I=(I(id_bess_pay_total)+{price_offset})/(I(id_bess_control)+{price_offset})
B§demand_price_offset 0 0 I=(I(id_demand_pay_total)+{price_offset})/(I(id_electricity_supply)+{price_offset})
V§id_wind_supply N009 w1 0
B§da_electricity_demand N014 0 I=I(electricity_demand)
B§da_solar_supply N011 0 I=I(solar_supply)
V§id_solar_supply N011 s1 0
V1 N014 0 0
V§id_electricity_supply N013 d1 0
bess_income 0 0 I=I(id_bess_control)*I(bess_price_offset)
B§wind_income 0 0 I=I(id_wind_supply)*I(wind_price_offset)
B§solar_income 0 0 I=I(id_solar_supply)*I(solar_price_offset)
B§demand_income 0 0 I=I(id_electricity_supply)*I(demand_price_offset)
bess_income_acc 0 0 I=idt(I(bess_income))
B§wind_income_acc 0 0 I=idt(I(wind_income))
B§solar_income_acc 0 0 I=idt(I(solar_income))
B§demand_income_acc 0 0 I=idt(I(demand_income))
B§gas_price_offset 0 0 I=(I(id_gas_pay_total)+{price_offset})/(I(id_gas)+{price_offset})
B§gas_income 0 0 I=I(id_gas)*I(gas_price_offset)
B§gas_income_acc 0 0 I=idt(I(gas_income))
B§offer_adjust P002 0 V={Kp}*I(id_market_clearing)+{Ki}*idt(I(id_market_clearing))
B§imbal_electricity_demand bsp2 0 I=I(id_bal_supply)
L§bsp_supply 0 bsp2 1
B§imbal_price 0 0 I=idt(V(bsp1)-V(bsp2))*10
B§da_bess_income_acc 0 0 I=idt(I(bess_da_income))
B§da_gas_income_acc 0 0 I=idt(I(gas_da_income))
B§da_wind_income_acc 0 0 I=idt(I(wind_da_income))
B§da_solar_income_acc 0 0 I=idt(I(solar_da_income))
B§offer_adjust_incentive_test NC_07 NC_08 V={Kp}*V(offer_incentive)+{Ki}*idt(V(offer_incentive))
B1 ib2 d2 V=0
R§da_market_clearing da_supply_incentive 0 50
B§da_coal_income_acc 0 0 I=idt(I(coal_da_income))
B§id_incentive_to_supply 0 0 I=-V(id_supply_incentive)
B§cleared_orders_new mcp 0 V = if( (I(R4)<1e-6) + (I(R5)<1e-6) > 0,min(I(R1), I(R2)),max(I(R4), I(R5)) )
.model D D
.lib standard.dio
* Solar energy supply [MW]
* Solar sector
* Wind sector
* Nuclear sector
* Wind energy supply [MW]
* Nuclear energy supply [MW]
* Coal sector
* Gas sector
* Coal energy supply [MW]
* Gas energy supply [MW]
* Settings
.param coal_capacity = 0.6
.param coal_baseload = 0.2
.param coal_rampup=0.2
.param gas_baseload = 0.05
.param gas_rampup = 0.01
.param solar_marg_price = 0.1
.param wind_marg_price=0.1
.param nuclear_marg_price = 0.05
* Parameters
.tran 24s
* Simulation
* Retailers
* Energy [MWh/h]
* DA market
.func active(x) {if(x > 1m, 1, 0)}
.func active_offer(supply, offer) {active(supply)* offer}
* Solar DA income [$/h]
* Wind DA income [$/h]
* Nuclear DA income [$/h]
* Coal DA income [$/h]
* Gas DA income [$/h]
* Gas DA offer [offer/h]
* Coal DA offer [offer/h]
* Nuclear DA offer [offer/h]
* Wind DA offer [offer/h]
* Solar DA offer [offer/h]
* Money [$/h]
.param wind_input="wind_supply_curtail_old.txt"
.param solar_input="solar_supply.txt"
.param price_offset = 1.5
.param folder="C:\Users\moste\OneDrive - Delft University of Technology\Documenten\Studie\Systems and Control\Economic Engineering\Thesis\Models\Final\Data\Daily\"
* High wind
* .param wind_input="wind_supply.txt"
* .param solar_input="solar_supply_low.txt"
* .param price_offset = 0.5
* Low solar
* Scenarios
* BESS sector
* Insights
* Day-ahead market
* Solar energy supply [MW]
* Solar sector
* Wind sector
* Wind energy supply [MW]
* Gas sector
* Gas energy supply [MW]
* Energy [MW]
* Gas ID payment [$/h]
* Wind ID payment [$/h]
* Solar ID payment [$/h]
* Money [$/h]
* BESS sector
* Intraday market
KF1 id_wind_pay_el L1 0
* BESS ID payment [$/h]
* .param wind_input="wind_supply_curtail.txt"
* .param solar_input="solar_supply_low.txt"
* .param price_offset = 1.1
* High wind, low solar
* BESS energy supply [MW]
KF2 id_solar_pay_el L3 0
.param Kp = -10
.param Ki = -1
* PI control
KF3 id_bess_pay_el id_bess_control 0
KF4 id_gas_pay_el id_gas_supply 0
KF5 id_demand_pay_el L2 0
* Retailers
* .param Kp_bal=-45
* .param Ki_bal=-6
* Demand ID payment [$/h]
* Balancing market
* Offer matching
* ID
* prices
* ID income
* Accumulated ID
* income
.param Kp_bal=-20
.param Ki_bal=-18
* TSO
* BSP sector
* .param wind_input="wind_supply.txt"
* .param solar_input="solar_supply.txt"
* .param price_offset = 1.1
* Medium wind and solar
* .param Kp = -50
* .param Ki = -5
* Accumulated DA
* income
* BESS energy supply [MW]
* BESS DA income [$/h]
* BESS DA offer [offer/h]
.backanno
.end